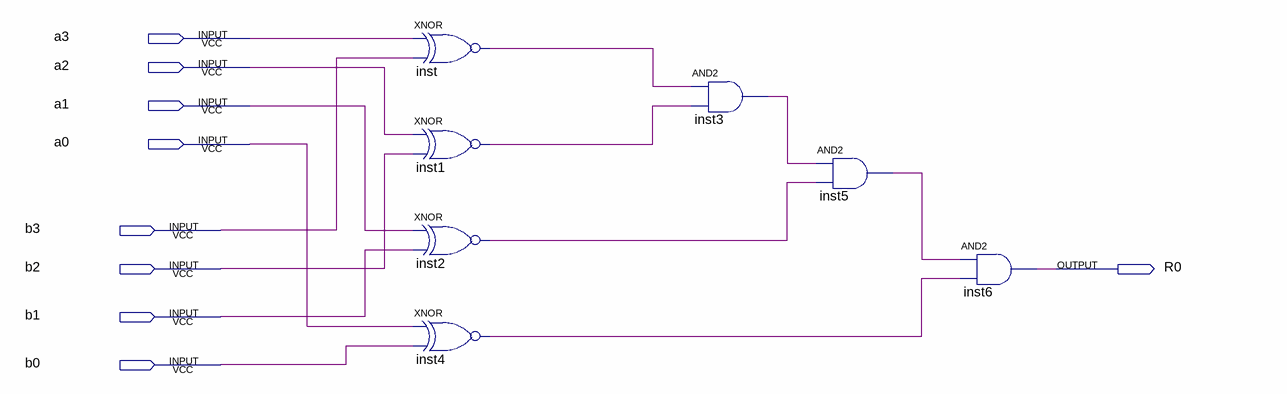
[diagram p0: schematic sheet]
// Quartus schematic Comparador4bits.bdf as structural Verilog: 7 symbols, 9 pins
module Comparador4bits (
  input  a3,
  input  a2,
  input  a1,
  input  a0,
  input  b3,
  input  b2,
  input  b1,
  input  b0,
  output R0
);

  wire inst1_out, inst2_out, inst3_out, inst4_out, inst5_out, inst_out;

  xnor inst (inst_out, a3, b3);
  xnor inst1 (inst1_out, a2, b2);
  xnor inst2 (inst2_out, a1, b1);
  xnor inst4 (inst4_out, a0, b0);
  and inst3 (inst3_out, inst_out, inst1_out);
  and inst5 (inst5_out, inst3_out, inst2_out);
  and inst6 (R0, inst5_out, inst4_out);
endmodule
